# Altium schematic sheet 04_Motor.SchDoc
size A
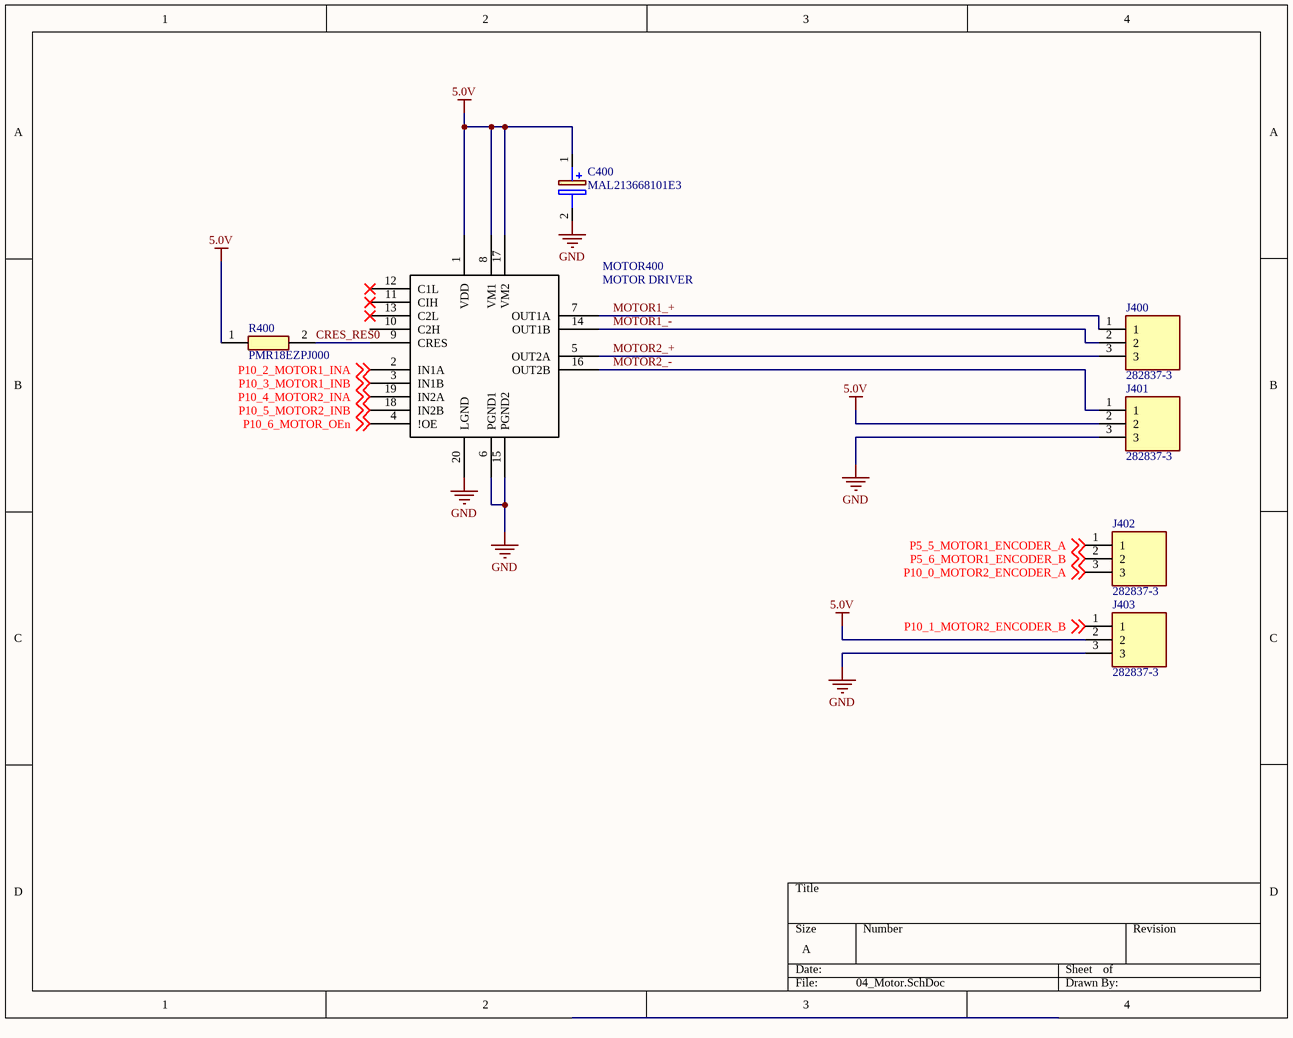
[diagram p0: 04_Motor.SchDoc]

## Parts
C400  MAL213668101E3  [CAPPRD500W60D1050H1750]
J400  282837-3  [2828373]
J401  282837-3  [2828373]
J402  282837-3  [2828373]
J403  282837-3  [2828373]
MOTOR400  MOTOR DRIVER  [SOP65P640X120-20N]
R400  PMR18EZPJ000  [RESC3216X42N]

## Nets
5.0V: C400.1(+) J401.2 J403.2 MOTOR400.1(VDD) MOTOR400.8(VM1) MOTOR400.17(VM2) R400.1
GND: C400.2(-) J401.3 J403.3 MOTOR400.6(PGND1) MOTOR400.15(PGND2) MOTOR400.20(LGND)
CRES_RES0: MOTOR400.9(CRES) R400.2
MOTOR1_+: J400.1 MOTOR400.7(OUT1A)
MOTOR1_-: J400.2 MOTOR400.14(OUT1B)
MOTOR2_+: J400.3 MOTOR400.5(OUT2A)
MOTOR2_-: J401.1 MOTOR400.16(OUT2B)
P5_5_MOTOR1_ENCODER_A: J402.1 ; off-sheet P5_5_MOTOR1_ENCODER_A
P5_6_MOTOR1_ENCODER_B: J402.2 ; off-sheet P5_6_MOTOR1_ENCODER_B
P10_0_MOTOR2_ENCODER_A: J402.3 ; off-sheet P10_0_MOTOR2_ENCODER_A
P10_1_MOTOR2_ENCODER_B: J403.1 ; off-sheet P10_1_MOTOR2_ENCODER_B
P10_2_MOTOR1_INA: MOTOR400.2(IN1A) ; off-sheet P10_2_MOTOR1_INA
P10_3_MOTOR1_INB: MOTOR400.3(IN1B) ; off-sheet P10_3_MOTOR1_INB
P10_4_MOTOR2_INA: MOTOR400.19(IN2A) ; off-sheet P10_4_MOTOR2_INA
P10_5_MOTOR2_INB: MOTOR400.18(IN2B) ; off-sheet P10_5_MOTOR2_INB
P10_6_MOTOR_OEn: MOTOR400.4(!OE) ; off-sheet P10_6_MOTOR_OEn

Not connected (* = marked no-connect by the designer): MOTOR400 10(C2H) 11(CIH)* 12(C1L)* 13(C2L)*

## Library data of the parts
C400 = MAL213668101E3: Capacitor Polarised; Manufacturer_Name: Vishay; Datasheet Link: https://componentsearchengine.com//MAL213668101E3.pdf; Height: 17.5mm; Mouser2 Part Number: N/A; Mouser2 Price/Stock: https://www.mouser.com/Search/Refine.aspx?Keyword=N%2FA; Manufacturer_Part_Number: MAL213668101E3
J400-J403 = 282837-3: Connector; Manufacturer_Name: TE Connectivity; Height: 10.3mm; Manufacturer_Part_Number: 282837-3
MOTOR400 = SOP65P64X1
R400 = PMR18EZPJ000: Resistor; Manufacturer_Name: ROHM Semiconductor; Datasheet Link: https://fscdn.rohm.com/en/products/databook/datasheet/passive/resistor/chip_resistor/pmr-jpw-e.pdf; Height: 0.42mm; Manufacturer_Part_Number: PMR18EZPJ000